# Altium project LittleWing++.PrjPcb
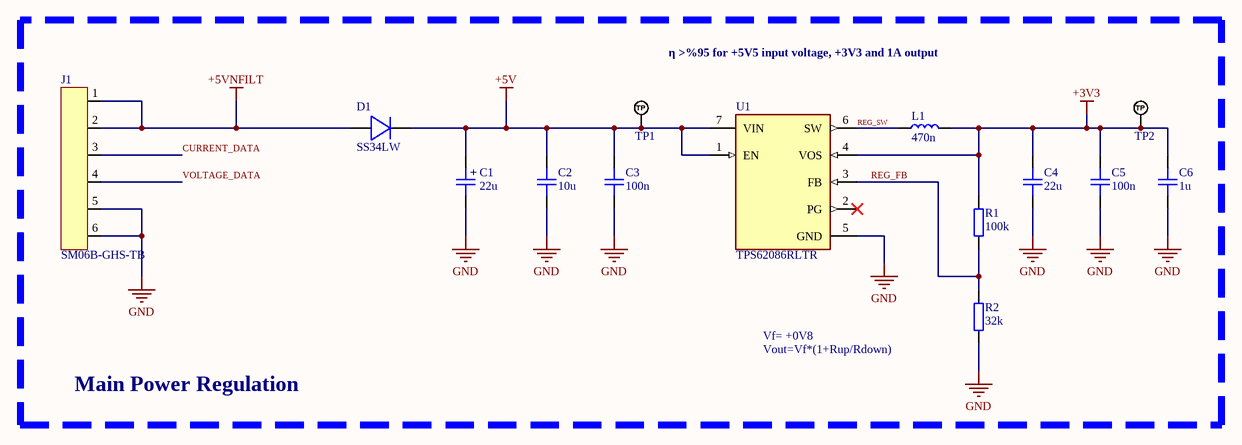
[diagram p0: Power.SchDoc]
4 sheets, 70 parts. Net scope: global (net labels, ports and power ports of the same name join across sheets).
Board file: LittleWing++.PcbDoc
Sheets:
  Power.SchDoc
  MCU.SchDoc
  Sensors.SchDoc
  Connectors.SchDoc

## Sheet Power.SchDoc
size A; DocumentNumber: 1; SheetNumber: 1; SheetTotal: 4

### Parts
C1  22u  [CAP_AE_SMD_D6MM3_H5M55]
C2  10u  [CAP_1206]
C3  100n  [CAP_0402]
C4  22u  [CAP_1210]
C5  100n  [CAP_0402]
C6  1u  [CAP_0402]
D1  SS34LW  [SOD-123W]
J1  SM06B-GHS-TB  [SM06B-GHS-TB]
L1  470n  [IND_1008]
R1  100k  [RES_0402]
R2  32k  [RES_0402]
TP1  TP_NOBOM  [PAD_RND_1MM]  (value not drawn)  (no BOM)
TP2  TP_NOBOM  [PAD_RND_1MM]  (value not drawn)  (no BOM)
U1  TPS62086RLTR  [FP-RLT0007A-MFG]

### Nets
+3V3: C4.2 C5.2 C6.2 L1.2 R1.2 TP2.1(TP) U1.4(VOS)
+5V: C1.1 C2.2 C3.2 D1.2 TP1.1(TP) U1.1(EN) U1.7(VIN)
+5VNFILT: D1.1 J1.1 J1.2
GND: C1.2 C2.1 C3.1 C4.1 C5.1 C6.1 J1.5 J1.6 R2.1 U1.5(GND)
CURRENT_DATA: J1.3
REG_FB: R1.1 R2.2 U1.3(FB)
REG_SW: L1.1 U1.6(SW)
VOLTAGE_DATA: J1.4

Not connected (* = marked no-connect by the designer): U1 2(PG)*

### Notes on the sheet
- η >%95 for +5V5 input voltage, +3V3 and 1A output
- Vout=Vf*(1+Rup/Rdown)
- Vf= +0V8
- Main Power Regulation
- (in symbol CAP_ALEL_6.3x5.5) +

### Library data of the parts
C1 = CAP_ALEL_6.3x5.5: Capacitor SMD Aluminium Electrolytic 6.3mm Diameter 5.5mm Height; Manufacturer: *; Manufacturer Part Number: *; Distributor Link: *; LCSC: *
C2 = CAP_1206: Capacitor SMD 1206; Manufacturer: *; Manufacturer Part Number: *; Distributor Link: *; LCSC: *; Rating: *; Dielectric: *
C3 C5 C6 = CAP_0402: Capacitor SMD 0402; Manufacturer: *; Manufacturer Part Number: *; Distributor Link: *; LCSC: *; Rating: *; Dielectric: *
C4 = CAP_1210: Capacitor SMD 1210; Manufacturer: *; Manufacturer Part Number: *; Distributor Link: *; LCSC: *; Rating: *; Dielectric: *
D1 = SS34LW: 3A, 40V - 200V Schottky Barrier Surface Mount Rectifier
J1 = SM06B-GHS-TB: Header Connector 6 Position 1.25MM Pitch SMD Horizontal JST GH; Manufacturer: JST; Manufacturer Part Number: SM06B-GHS-TB
L1 = IND_1008: Inductor SMD 1008
R1 R2 = RES_0402: Resistor SMD 0402; Manufacturer: *; Manufacturer Part Number: *; Distributor Link: *; LCSC: *
TP1 TP2 = TEST_POINT_RND_1MM: Test Point Round 1mm (NO BOM)
U1 = CMP-04918-000186-1: IC REG BUCK 3.3V 3A 7VSON-HR; Switching Frequency: 2.4MHz; Output Type: Fixed; Output Configuration: Positive; Synchronous Rectifier: Yes; Min Input Voltage: 2.5V; Operating Supply Voltage: 6V; Efficiency: 95%; Number of Outputs: 1; Package Quantity: 3000; Packaging: Tape and Reel; Output Voltage: 3.3V; Case/Package: VQFN; RoHS Compliant: Yes; Output Current: 3A; Max Input Voltage: 6V; Min Operating Temperature: -40°C; Lead Free: Lead Free; Max Operating Temperature: 125°C; Mount: Surface Mount; Number of Pins: 7; Min Output Voltage: 3.3V; Radiation Hardening: No; Max Output Current: 3A

## Sheet MCU.SchDoc
size A3; DocumentNumber: 2; SheetNumber: 2; SheetTotal: 4
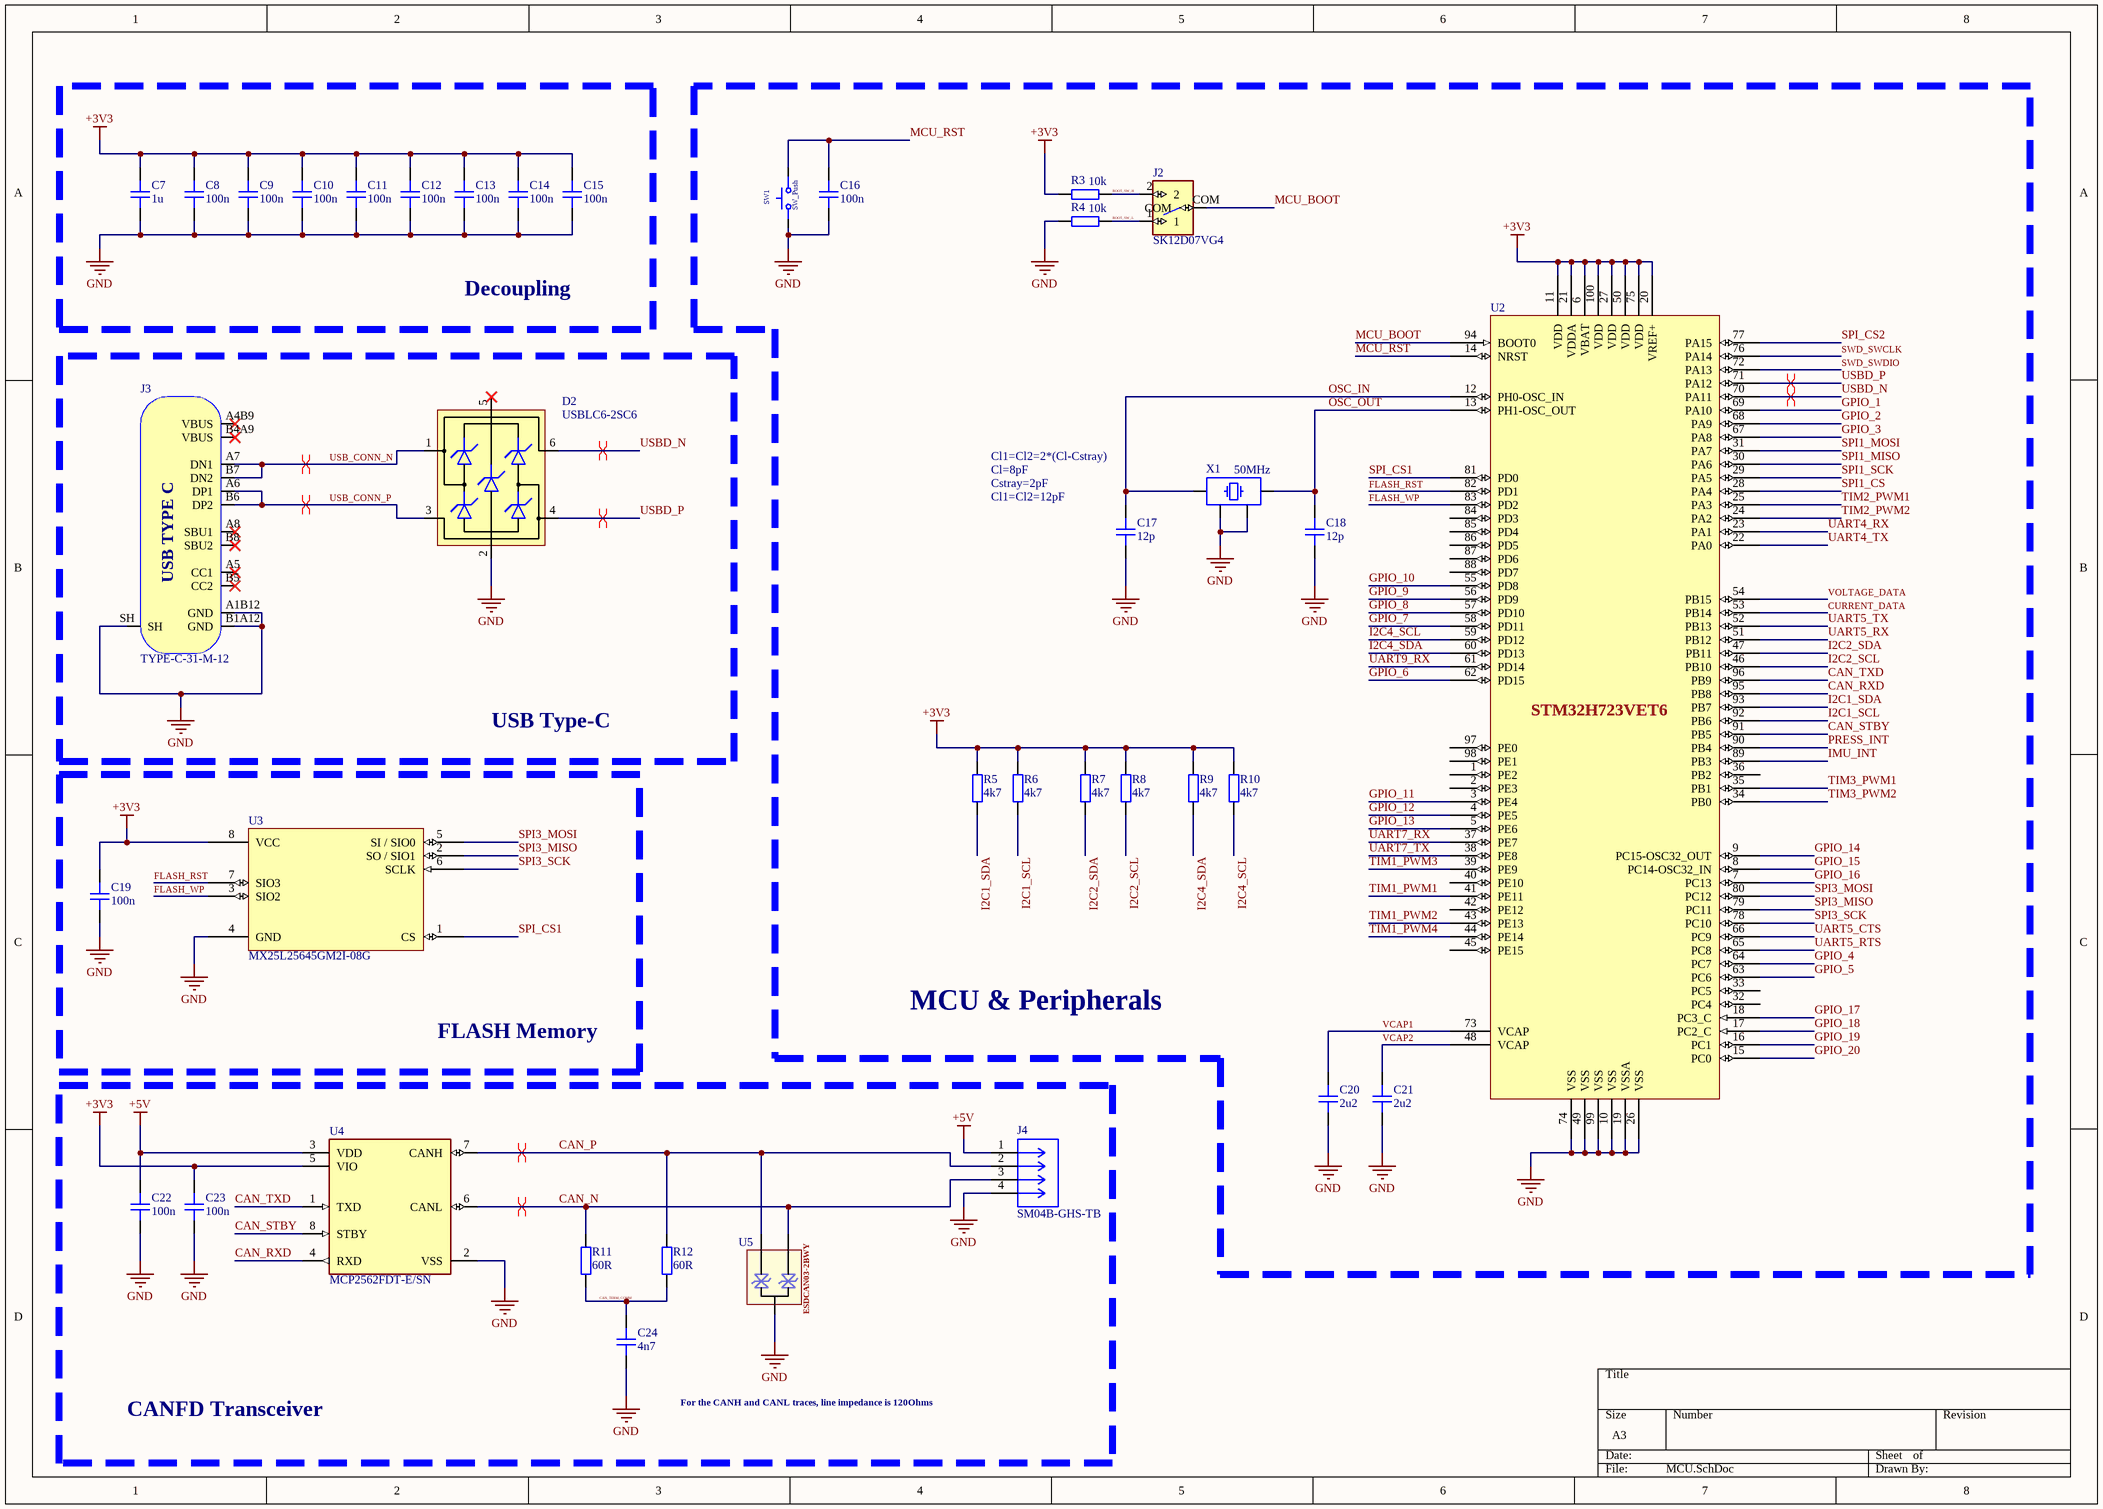
[diagram p1: MCU.SchDoc]

### Parts
C7  1u  [CAP_0402]
C8  100n  [CAP_0402]
C9  100n  [CAP_0402]
C10  100n  [CAP_0402]
C11  100n  [CAP_0402]
C12  100n  [CAP_0402]
C13  100n  [CAP_0402]
C14  100n  [CAP_0402]
C15  100n  [CAP_0402]
C16  100n  [CAP_0402]
C17  12p  [CAP_0402]
C18  12p  [CAP_0402]
C19  100n  [CAP_0402]
C20  2u2  [CAP_0402]
C21  2u2  [CAP_0402]
C22  100n  [CAP_0402]
C23  100n  [CAP_0402]
C24  4n7  [CAP_0402]
D2  USBLC6-2SC6  [SOT-23-6]
J2  SK12D07VG4  [SK12D07VG4]
J3  TYPE-C-31-M-12  [TYPE-C-31-M-12]
J4  SM04B-GHS-TB  [CONN_SM04B-GHS-TB_JST]
R3  10k  [RES_0402]
R4  10k  [RES_0402]
R5  4k7  [RES_0402]
R6  4k7  [RES_0402]
R7  4k7  [RES_0402]
R8  4k7  [RES_0402]
R9  4k7  [RES_0402]
R10  4k7  [RES_0402]
R11  60R  [RES_0402]
R12  60R  [RES_0402]
SW1  SW_Push  [4-PIN BUTTON]
U2  STM32H723VET6  [LQFP100]
U3  MX25L25645GM2I-08G  [SOP8]
U4  MCP2562FDT-E/SN  [FP-C04-057-SN-MFG]
U5  ESDCAN03-2BWY  [SOT65P210X110-3N]
X1  50MHz  [XTAL_3225]

### Blocks framed on the sheet
Decoupling: C7-C15
MCU & Peripherals: C16-C18 C20 C21 J2 R3-R10 SW1 U2 X1
USB Type-C: D2 J3
FLASH Memory: C19 U3
CANFD Transceiver: C22-C24 J4 R11 R12 U4 U5

### Nets
+3V3: C7.2 C8.2 C9.2 C10.2 C11.2 C12.2 C13.2 C14.2 C15.2 C19.2 C23.2 R3.1 R5.2 R6.2 R7.2 R8.2 R9.2 R10.2 U2.6(VBAT) U2.11(VDD) U2.20(VREF+) U2.21(VDDA) U2.27(VDD) U2.50(VDD) U2.75(VDD) U2.100(VDD) U3.8(VCC) U4.5(VIO)
+5V: C22.2 J4.1 U4.3(VDD)
GND: C7.1 C8.1 C9.1 C10.1 C11.1 C12.1 C13.1 C14.1 C15.1 C16.1 C17.1 C18.1 C19.1 C20.1 C21.1 C22.1 C23.1 C24.1 D2.2(GND) J3.A1B12(GND) J3.B1A12(GND) J3.SH J4.4 R4.1 SW1.1 U2.10(VSS) U2.19(VSSA) U2.26(VSS) U2.49(VSS) U2.74(VSS) U2.99(VSS) U3.4(GND) U4.2(VSS) U5.3 X1.2 X1.4
BOOT_SW_H: J2.2 R3.2
BOOT_SW_L: J2.1 R4.2
CAN_N: J4.3 R11.2 U4.6(CANL) U5.2
CAN_P: J4.2 R12.2 U4.7(CANH) U5.1
CAN_RXD: U2.95(PB8) U4.4(RXD)
CAN_STBY: U2.91(PB5) U4.8(STBY)
CAN_TERM_COMM: C24.2 R11.1 R12.1
CAN_TXD: U2.96(PB9) U4.1(TXD)
CURRENT_DATA: U2.53(PB14)
FLASH_RST: U2.82(PD1) U3.7(SIO3)
FLASH_WP: U2.83(PD2) U3.3(SIO2)
GPIO_1: U2.69(PA10)
GPIO_2: U2.68(PA9)
GPIO_3: U2.67(PA8)
GPIO_4: U2.64(PC7)
GPIO_5: U2.63(PC6)
GPIO_6: U2.62(PD15)
GPIO_7: U2.58(PD11)
GPIO_8: U2.57(PD10)
GPIO_9: U2.56(PD9)
GPIO_10: U2.55(PD8)
GPIO_11: U2.3(PE4)
GPIO_12: U2.4(PE5)
GPIO_13: U2.5(PE6)
GPIO_14: U2.9(PC15-OSC32_OUT)
GPIO_15: U2.8(PC14-OSC32_IN)
GPIO_16: U2.7(PC13)
GPIO_17: U2.18(PC3_C)
GPIO_18: U2.17(PC2_C)
GPIO_19: U2.16(PC1)
GPIO_20: U2.15(PC0)
I2C1_SCL: R6.1 U2.92(PB6)
I2C1_SDA: R5.1 U2.93(PB7)
I2C2_SCL: R8.1 U2.46(PB10)
I2C2_SDA: R7.1 U2.47(PB11)
I2C4_SCL: R10.1 U2.59(PD12)
I2C4_SDA: R9.1 U2.60(PD13)
IMU_INT: U2.89(PB3)
MCU_BOOT: J2.COM U2.94(BOOT0)
MCU_RST: C16.2 SW1.2 U2.14(NRST)
OSC_IN: C17.2 U2.12(PH0-OSC_IN) X1.1
OSC_OUT: C18.2 U2.13(PH1-OSC_OUT) X1.3
PRESS_INT: U2.90(PB4)
SPI1_CS: U2.28(PA4)
SPI1_MISO: U2.30(PA6)
SPI1_MOSI: U2.31(PA7)
SPI1_SCK: U2.29(PA5)
SPI3_MISO: U2.79(PC11) U3.2(SO_/_SIO1)
SPI3_MOSI: U2.80(PC12) U3.5(SI_/_SIO0)
SPI3_SCK: U2.78(PC10) U3.6(SCLK)
SPI_CS1: U2.81(PD0) U3.1(CS)
SPI_CS2: U2.77(PA15)
SWD_SWCLK: U2.76(PA14)
SWD_SWDIO: U2.72(PA13)
TIM1_PWM1: U2.41(PE11)
TIM1_PWM2: U2.43(PE13)
TIM1_PWM3: U2.39(PE9)
TIM1_PWM4: U2.44(PE14)
TIM2_PWM1: U2.25(PA3)
TIM2_PWM2: U2.24(PA2)
TIM3_PWM1: U2.35(PB1)
TIM3_PWM2: U2.34(PB0)
UART4_RX: U2.23(PA1)
UART4_TX: U2.22(PA0)
UART5_CTS: U2.66(PC9)
UART5_RTS: U2.65(PC8)
UART5_RX: U2.51(PB12)
UART5_TX: U2.52(PB13)
UART7_RX: U2.37(PE7)
UART7_TX: U2.38(PE8)
UART9_RX: U2.61(PD14)
USB_CONN_N: D2.1(IO1) J3.A7(DN1) J3.B7(DN2)
USB_CONN_P: D2.3(IO2) J3.A6(DP1) J3.B6(DP2)
USBD_N: D2.6(IO1) U2.70(PA11)
USBD_P: D2.4(IO2) U2.71(PA12)
VCAP1: C20.2 U2.73(VCAP)
VCAP2: C21.2 U2.48(VCAP)
VOLTAGE_DATA: U2.54(PB15)

Not connected (* = marked no-connect by the designer): D2 5(VBUS)*; J3 A4B9(VBUS)* A5(CC1)* A8(SBU1)* B4A9(VBUS)* B5(CC2)* B8(SBU2)*; U2 1(PE2) 2(PE3) 32(PC4) 33(PC5) 36(PB2) 40(PE10) 42(PE12) 45(PE15) 84(PD3) 85(PD4) 86(PD5) 87(PD6) 88(PD7) 97(PE0) 98(PE1)

### Layout directives
differential pair: CAN_N, CAN_P, USB_CONN_N, USB_CONN_P, USBD_N, USBD_P

### Notes on the sheet
- Cl1=Cl2=2*(Cl-Cstray)
- Cl=8pF
- Cstray=2pF
- Cl1=Cl2=12pF
- For the CANH and CANL traces, line impedance is 120Ohms
- (in symbol TYPE-C-31-M-12) USB TYPE C

### Library data of the parts
C7-C24 = CAP_0402: Capacitor SMD 0402; Manufacturer: *; Manufacturer Part Number: *; Distributor Link: *; LCSC: *; Rating: *; Dielectric: *
D2 = USBLC6-2SC6: Low-Capacitance ESD Protection USB; Manufacturer: STMicroelectronics; Manufacturer Part Number: USBLC6-2SC6; Distributor Link: https://www.mouser.de/ProductDetail/STMicroelectronics/USBLC6-2SC6?qs=po45yt2pPpu%2FhNIlwQdTlg%3D%3D
J2 = SK12D07VG4: Switch Slide ON ON SPDT Side Slide 0.3A 30VDC PC Pins Bracket Mount/Through Hole Bulk; MF: C&K; SnapEDA_Link: https://www.snapeda.com/parts/SK12D07VG4/C%2526K/view-part/?ref=snap; Package: None; Value: *; MP: SK12D07VG4; Check_prices: https://www.snapeda.com/parts/SK12D07VG4/C%2526K/view-part/?ref=eda
J3 = TYPE-C-31-M-12: USB Type C Connector Horizontal SMT; Manufacturer: Koren Hroparts; Manufacturer Part Number: TYPE-C-31-M-12
J4 = SM04B-GHS-TB: Connector Header Surface Mount, Right Angle 4 position 0.049 (1.25mm); MF: JST Sales; SnapEDA_Link: https://www.snapeda.com/parts/SM04B-GHS-TB/JST/view-part/?ref=snap; Package: None; Value: *; MP: SM04B-GHS-TB; Check_prices: https://www.snapeda.com/parts/SM04B-GHS-TB/JST/view-part/?ref=eda
R3-R12 = RES_0402: Resistor SMD 0402; Manufacturer: *; Manufacturer Part Number: *; Distributor Link: *; LCSC: *
SW1 = Push Switch
U2 = STM32H723VET6: Arm® Cortex®-M7 32-bit 550 MHz MCU, up to 1 MB flash, 564 KB / RAM, Ethernet, USB, 3x FDCAN, Graphics, 2x 16-bit ADCs
U3 = MX25L25673GM2I-08G: FLASH - NOR Memory IC 256Mbit SPI 120 MHz 8-SOP
U4 = CMP-06279-000005-1: IC TRANSCEIVER 1/1 8SOIC; Operating Supply Current: 70mA; Data Rate: 8Mbps; Number of Transceivers: 1; Receiver Hysteresis: 200mV; Max Supply Voltage: 5.5V; Min Supply Voltage: 4.5V; Weight: 0.019048oz; Package Quantity: 3300; Case/Package: SOIC; Mount: Surface Mount; Max Operating Temperature: 125°C; Min Operating Temperature: -40°C; Packaging: Tape and Reel; Number of Pins: 8
X1 = TSX-3225_24.0000MF15X-AC: WURTH 830108207809; Manufacturer: Epson; Manufacturer Part Number: TSX-3225 24.0000MF15X-AC

## Sheet Sensors.SchDoc
size A; DocumentNumber: 3; SheetNumber: 3; SheetTotal: 4
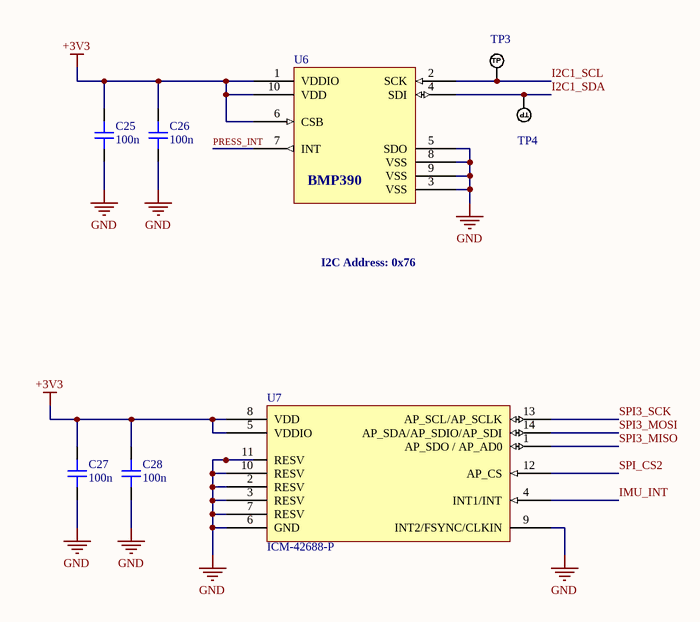
[diagram p2: Sensors.SchDoc]

### Parts
C25  100n  [CAP_0402]
C26  100n  [CAP_0402]
C27  100n  [CAP_0402]
C28  100n  [CAP_0402]
TP3  TP_NOBOM  [PAD_RND_1MM]  (value not drawn)  (no BOM)
TP4  TP_NOBOM  [PAD_RND_1MM]  (value not drawn)  (no BOM)
U6  BMP390  [LGA 10-pin ball]
U7  ICM-42688-P  [14 Lead LGA]

### Nets
+3V3: C25.2 C26.2 C27.2 C28.2 U6.1(VDDIO) U6.6(CSB) U6.10(VDD) U7.5(VDDIO) U7.8(VDD)
GND: C25.1 C26.1 C27.1 C28.1 U6.3(VSS) U6.5(SDO) U6.8(VSS) U6.9(VSS) U7.2(RESV) U7.3(RESV) U7.6(GND) U7.7(RESV) U7.9(INT2/FSYNC/CLKIN) U7.10(RESV) U7.11(RESV)
I2C1_SCL: TP3.1(TP) U6.2(SCK)
I2C1_SDA: TP4.1(TP) U6.4(SDI)
IMU_INT: U7.4(INT1/INT)
PRESS_INT: U6.7(INT)
SPI3_MISO: U7.1(AP_SDO_/_AP_AD0)
SPI3_MOSI: U7.14(AP_SDA/AP_SDIO/AP_SDI)
SPI3_SCK: U7.13(AP_SCL/AP_SCLK)
SPI_CS2: U7.12(AP_CS)

### Notes on the sheet
- I2C Address: 0x76

### Library data of the parts
C25-C28 = CAP_0402: Capacitor SMD 0402; Manufacturer: *; Manufacturer Part Number: *; Distributor Link: *; LCSC: *; Rating: *; Dielectric: *
TP3 TP4 = TEST_POINT_RND_1MM: Test Point Round 1mm (NO BOM)
U6 = BMP390: Pressure Sensor 4.35 ~ 18.13PSI (30 ~ 125kPa) Absolute 10-WFLGA
U7 = ICM-42688-P: High Precision 6-Axis MEMS MotionTrackingTM Device

## Sheet Connectors.SchDoc
size A; DocumentNumber: 4; SheetNumber: 4; SheetTotal: 4
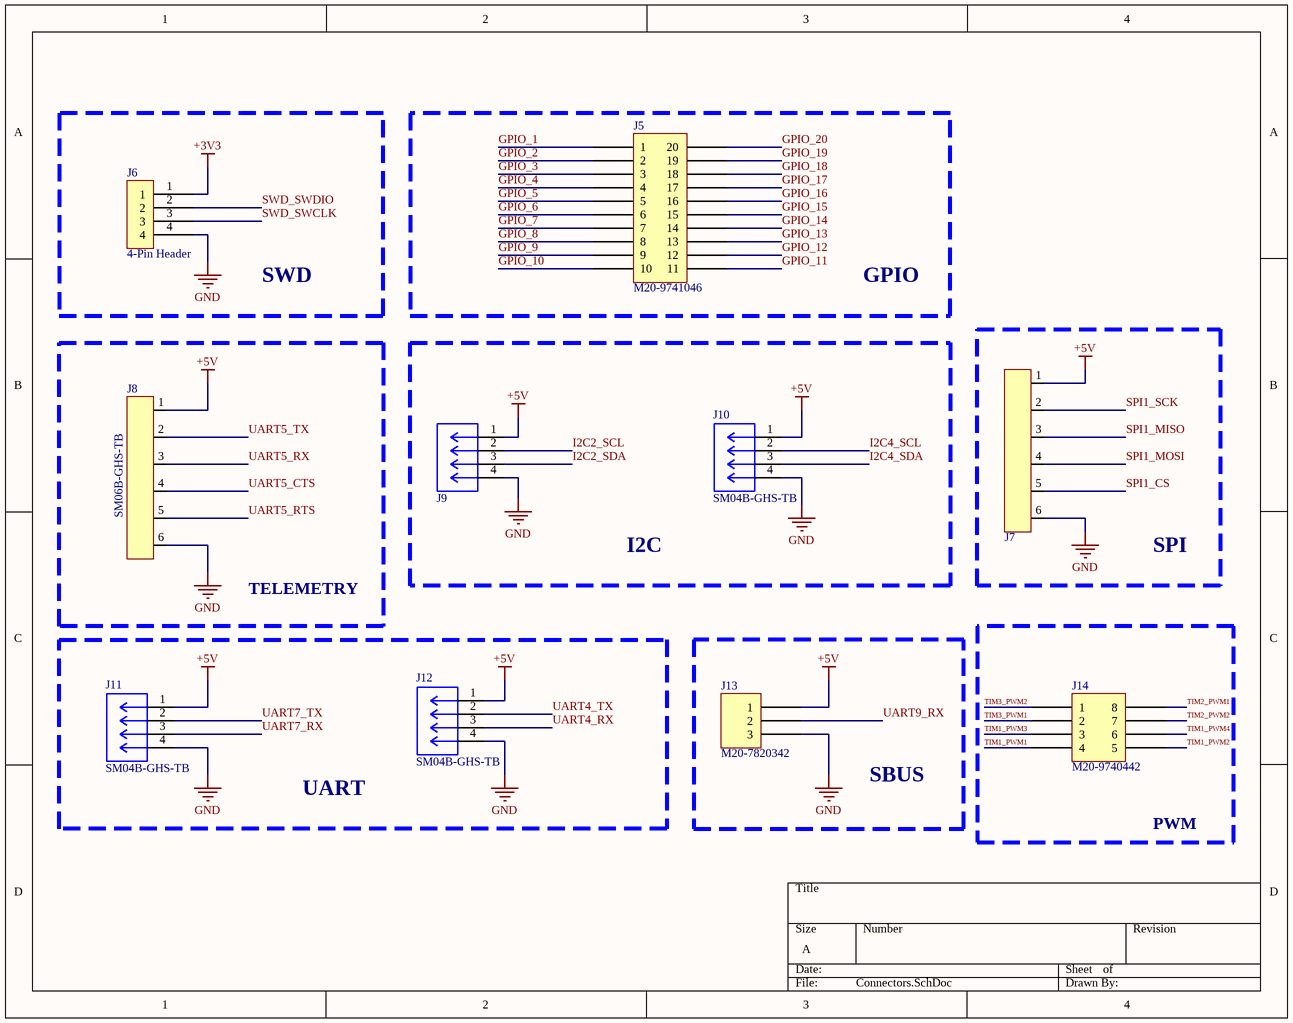
[diagram p3: Connectors.SchDoc]

### Parts
J5  M20-9741046  [HARWIN M20-9741045]
J6  4-Pin Header  [4-Pin Header]
J7  SM06B-GHS-TB  [SM06B-GHS-TB]  (value not drawn)
J8  SM06B-GHS-TB  [SM06B-GHS-TB]
J9  SM04B-GHS-TB  [CONN_SM04B-GHS-TB_JST]  (value not drawn)
J10  SM04B-GHS-TB  [CONN_SM04B-GHS-TB_JST]
J11  SM04B-GHS-TB  [CONN_SM04B-GHS-TB_JST]
J12  SM04B-GHS-TB  [CONN_SM04B-GHS-TB_JST]
J13  M20-7820342  [HARWIN M20-7820345]
J14  M20-9740442  [HARWIN M20-9740445]

### Blocks framed on the sheet
SWD: J6
GPIO: J5
SPI: J7
TELEMETRY: J8
I2C: J9 J10
UART: J11 J12
SBUS: J13
PWM: J14

### Nets
+3V3: J6.1
+5V: J7.1 J8.1 J9.1 J10.1 J11.1 J12.1 J13.1
GND: J6.4 J7.6 J8.6 J9.4 J10.4 J11.4 J12.4 J13.3
GPIO_1: J5.1
GPIO_2: J5.2
GPIO_3: J5.3
GPIO_4: J5.4
GPIO_5: J5.5
GPIO_6: J5.6
GPIO_7: J5.7
GPIO_8: J5.8
GPIO_9: J5.9
GPIO_10: J5.10
GPIO_11: J5.11
GPIO_12: J5.12
GPIO_13: J5.13
GPIO_14: J5.14
GPIO_15: J5.15
GPIO_16: J5.16
GPIO_17: J5.17
GPIO_18: J5.18
GPIO_19: J5.19
GPIO_20: J5.20
I2C2_SCL: J9.2
I2C2_SDA: J9.3
I2C4_SCL: J10.2
I2C4_SDA: J10.3
SPI1_CS: J7.5
SPI1_MISO: J7.3
SPI1_MOSI: J7.4
SPI1_SCK: J7.2
SWD_SWCLK: J6.3
SWD_SWDIO: J6.2
TIM1_PWM1: J14.4
TIM1_PWM2: J14.5
TIM1_PWM3: J14.3
TIM1_PWM4: J14.6
TIM2_PWM1: J14.8
TIM2_PWM2: J14.7
TIM3_PWM1: J14.2
TIM3_PWM2: J14.1
UART4_RX: J12.3
UART4_TX: J12.2
UART5_CTS: J8.4
UART5_RTS: J8.5
UART5_RX: J8.3
UART5_TX: J8.2
UART7_RX: J11.3
UART7_TX: J11.2
UART9_RX: J13.2

### Library data of the parts
J5 = M20-9741046: CONN HEADER R/A 20POS 2.54MM; Manufacturer: Harwin Inc.; Connector Type: Header, Cuttable; Current Rating (Amps): 3A per Contact; Material Flammability Rating: UL94 V-0; Number of Positions: 20; Number of Positions Loaded: All; Shrouding: Unshrouded; Style: Board to Board or Cable; Part Number: M20-9741046; ComponentLink1Description: Datasheet; ComponentLink1URL: https://cdn.harwin.com/pdfs/M20-974.pdf; ComponentLink2Description: DigiKey Link; ComponentLink2URL: http://digikey.com/product-detail/en/harwin-inc/M20-9741046/M20-9741046-ND/3920727; Contact Finish - Mating: Tin; Contact Finish - Post: Tin; Contact Material: Brass; Contact Shape: Square; Contact Type: Male Pin; Fastening Type: Push-Pull; Insulation Color: Black; Insulation Material: Polyamide (PA6T), Nylon 6T; LastUpdated: 21.09.2022 19:20:06; Lifecycle Status: Active; Minimum Order: 1200; Mounting Type: Through Hole, Right Angle; Number of Rows: 2; Operating Temperature: -40°C ~ 105°C; Packaging: Bulk; PartId: 162; Part Status: Active; Price: 0.31; Series: M20; Supplier 1: DigiKey; Supplier Part Number 1: M20-9741046-ND; Termination: Solder
J7 J8 = SM06B-GHS-TB: as J1 on sheet Power; Manufacturer: JST; Manufacturer Part Number: SM06B-GHS-TB
J9-J12 = SM04B-GHS-TB: as J4 on sheet MCU; SnapEDA_Link: https://www.snapeda.com/parts/SM04B-GHS-TB/JST/view-part/?ref=snap; Package: None; Value: *; MP: SM04B-GHS-TB; Check_prices: https://www.snapeda.com/parts/SM04B-GHS-TB/JST/view-part/?ref=eda
J13 = M20-7820342: CONN RCPT 3POS 0.1 GOLD PCB; Manufacturer: Harwin Inc.; Connector Type: Receptacle; Contact Length - Post: 0.118" (3.00mm); Current Rating (Amps): 3A; Mated Stacking Heights: 11.04mm, 12.63mm; Material Flammability Rating: UL94 V-0; Number of Positions: 3; Number of Positions Loaded: All; Pitch - Mating: 0.100" (2.54mm); Style: Board to Board or Cable; Part Number: M20-7820342; ComponentLink1Description: Datasheet; ComponentLink1URL: https://cdn.harwin.com/pdfs/Harwin_PC_Connectors_M20.pdf; ComponentLink2Description: DigiKey Link; ComponentLink2URL: https://www.digikey.com/en/products/detail/harwin-inc/M20-7820342/3727752; Contact Finish - Mating: Gold; Contact Finish - Post: Tin; Contact Finish Thickness - Mating: Flash; Contact Type: Female Socket; Fastening Type: Push-Pull; Insulation Color: Black; Insulation Height: 0.335" (8.51mm); LastUpdated: 21.09.2022 18:55:13; Lifecycle Status: Active; Minimum Order: 1; Mounting Type: Through Hole; Number of Rows: 1; Operating Temperature: -40°C ~ 105°C; Packaging: Tube; Part Status: Active; Price: 0.42; Series: M20; Supplier 1: DigiKey; Supplier Part Number 1: 952-1783-ND; Termination: Solder
J14 = M20-9740442: CONN HEADER R/A 8POS 2.54MM; Manufacturer: Harwin Inc.; Connector Type: Header, Cuttable; Current Rating (Amps): 3A per Contact; Material Flammability Rating: UL94 V-0; Number of Positions: 8; Number of Positions Loaded: All; Shrouding: Unshrouded; Style: Board to Board or Cable; Part Number: M20-9740442; ComponentLink1Description: Datasheet; ComponentLink1URL: https://cdn.harwin.com/pdfs/M20-974.pdf; ComponentLink2Description: DigiKey Link; ComponentLink2URL: http://digikey.com/product-detail/en/harwin-inc/M20-9740442/M20-9740442-ND/3920714; Contact Finish - Mating: Gold; Contact Finish - Post: Tin; Contact Material: Brass; Contact Shape: Square; Contact Type: Male Pin; Fastening Type: Push-Pull; Insulation Color: Black; Insulation Material: Polyamide (PA6T), Nylon 6T; LastUpdated: 21.09.2022 19:17:53; Lifecycle Status: Active; Minimum Order: 5000; Mounting Type: Through Hole, Right Angle; Number of Rows: 2; Operating Temperature: -40°C ~ 105°C; Packaging: Bulk; PartId: 157; Part Status: Active; Price: 0.18; Series: M20; Supplier 1: DigiKey; Supplier Part Number 1: M20-9740442-ND; Termination: Solder

## Nets that join several sheets
+3V3: Power (7 pins), MCU (28 pins), Sensors (9 pins), Connectors (J6.1)
+5V: Power (7 pins), MCU (C22.2 J4.1 U4.3), Connectors (7 pins)
GND: Power (10 pins), MCU (36 pins), Sensors (15 pins), Connectors (8 pins)
CURRENT_DATA: Power (J1.3), MCU (U2.53)
GPIO_1: MCU (U2.69), Connectors (J5.1)
GPIO_2: MCU (U2.68), Connectors (J5.2)
GPIO_3: MCU (U2.67), Connectors (J5.3)
GPIO_4: MCU (U2.64), Connectors (J5.4)
GPIO_5: MCU (U2.63), Connectors (J5.5)
GPIO_6: MCU (U2.62), Connectors (J5.6)
GPIO_7: MCU (U2.58), Connectors (J5.7)
GPIO_8: MCU (U2.57), Connectors (J5.8)
GPIO_9: MCU (U2.56), Connectors (J5.9)
GPIO_10: MCU (U2.55), Connectors (J5.10)
GPIO_11: MCU (U2.3), Connectors (J5.11)
GPIO_12: MCU (U2.4), Connectors (J5.12)
GPIO_13: MCU (U2.5), Connectors (J5.13)
GPIO_14: MCU (U2.9), Connectors (J5.14)
GPIO_15: MCU (U2.8), Connectors (J5.15)
GPIO_16: MCU (U2.7), Connectors (J5.16)
GPIO_17: MCU (U2.18), Connectors (J5.17)
GPIO_18: MCU (U2.17), Connectors (J5.18)
GPIO_19: MCU (U2.16), Connectors (J5.19)
GPIO_20: MCU (U2.15), Connectors (J5.20)
I2C1_SCL: MCU (R6.1 U2.92), Sensors (TP3.1 U6.2)
I2C1_SDA: MCU (R5.1 U2.93), Sensors (TP4.1 U6.4)
I2C2_SCL: MCU (R8.1 U2.46), Connectors (J9.2)
I2C2_SDA: MCU (R7.1 U2.47), Connectors (J9.3)
I2C4_SCL: MCU (R10.1 U2.59), Connectors (J10.2)
I2C4_SDA: MCU (R9.1 U2.60), Connectors (J10.3)
IMU_INT: MCU (U2.89), Sensors (U7.4)
PRESS_INT: MCU (U2.90), Sensors (U6.7)
SPI1_CS: MCU (U2.28), Connectors (J7.5)
SPI1_MISO: MCU (U2.30), Connectors (J7.3)
SPI1_MOSI: MCU (U2.31), Connectors (J7.4)
SPI1_SCK: MCU (U2.29), Connectors (J7.2)
SPI3_MISO: MCU (U2.79 U3.2), Sensors (U7.1)
SPI3_MOSI: MCU (U2.80 U3.5), Sensors (U7.14)
SPI3_SCK: MCU (U2.78 U3.6), Sensors (U7.13)
SPI_CS2: MCU (U2.77), Sensors (U7.12)
SWD_SWCLK: MCU (U2.76), Connectors (J6.3)
SWD_SWDIO: MCU (U2.72), Connectors (J6.2)
TIM1_PWM1: MCU (U2.41), Connectors (J14.4)
TIM1_PWM2: MCU (U2.43), Connectors (J14.5)
TIM1_PWM3: MCU (U2.39), Connectors (J14.3)
TIM1_PWM4: MCU (U2.44), Connectors (J14.6)
TIM2_PWM1: MCU (U2.25), Connectors (J14.8)
TIM2_PWM2: MCU (U2.24), Connectors (J14.7)
TIM3_PWM1: MCU (U2.35), Connectors (J14.2)
TIM3_PWM2: MCU (U2.34), Connectors (J14.1)
UART4_RX: MCU (U2.23), Connectors (J12.3)
UART4_TX: MCU (U2.22), Connectors (J12.2)
UART5_CTS: MCU (U2.66), Connectors (J8.4)
UART5_RTS: MCU (U2.65), Connectors (J8.5)
UART5_RX: MCU (U2.51), Connectors (J8.3)
UART5_TX: MCU (U2.52), Connectors (J8.2)
UART7_RX: MCU (U2.37), Connectors (J11.3)
UART7_TX: MCU (U2.38), Connectors (J11.2)
UART9_RX: MCU (U2.61), Connectors (J13.2)
VOLTAGE_DATA: Power (J1.4), MCU (U2.54)